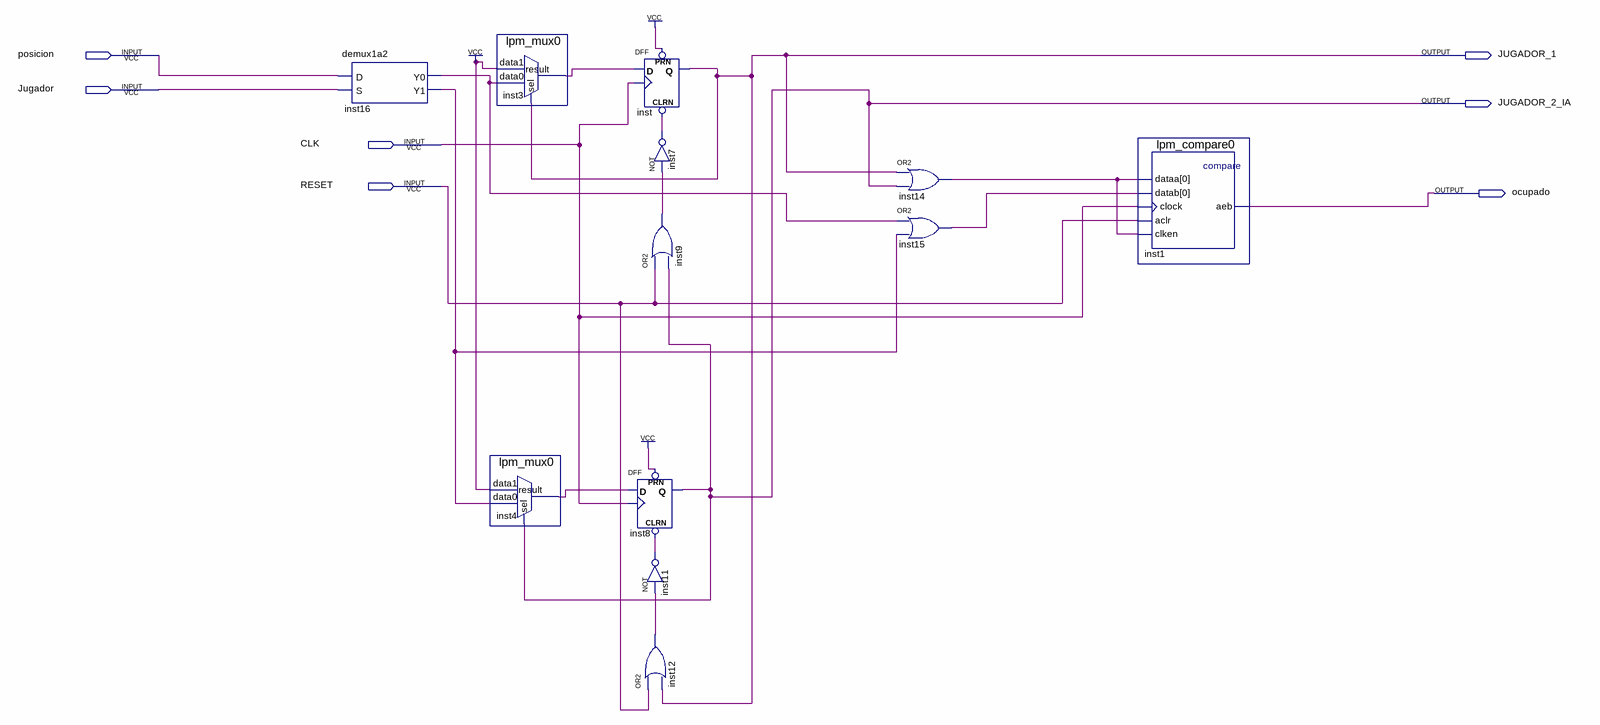
[diagram p0: schematic sheet]
// Quartus schematic Almace1.bdf as structural Verilog: 12 symbols, 7 pins
module Almace1 (
  input  posicion,
  input  Jugador,
  input  CLK,
  input  RESET,
  output JUGADOR_1,
  output JUGADOR_2_IA,
  output ocupado
);

  wire inst3_result, inst4_result, inst7_out, inst9_out, inst11_out, inst12_out, inst14_out, inst15_out,
       inst16_y0, inst16_y1;

  demux1a2 inst16 (.D(posicion), .S(Jugador), .Y0(inst16_y0), .Y1(inst16_y1));
  lpm_mux0 inst3 (.data1(1'b1), .data0(inst16_y0), .sel(JUGADOR_1), .result(inst3_result));
  lpm_mux0 inst4 (.data1(1'b1), .data0(inst16_y1), .sel(JUGADOR_2_IA), .result(inst4_result));
  DFF inst8 (.CLRN(inst11_out), .CLK(CLK), .D(inst4_result), .PRN(1'b1), .Q(JUGADOR_2_IA));
  DFF inst (.CLRN(inst7_out), .CLK(CLK), .D(inst3_result), .PRN(1'b1), .Q(JUGADOR_1));
  not inst7 (inst7_out, inst9_out);
  or inst9 (inst9_out, RESET, JUGADOR_2_IA);
  not inst11 (inst11_out, inst12_out);
  or inst12 (inst12_out, RESET, JUGADOR_1);
  or inst14 (inst14_out, JUGADOR_1, JUGADOR_2_IA);
  or inst15 (inst15_out, inst16_y0, inst16_y1);
  lpm_compare0 inst1 (
    .dataa(inst14_out), .datab(inst15_out), .clock(CLK), .aclr(RESET), .clken(inst14_out), .aeb(ocupado));
endmodule
